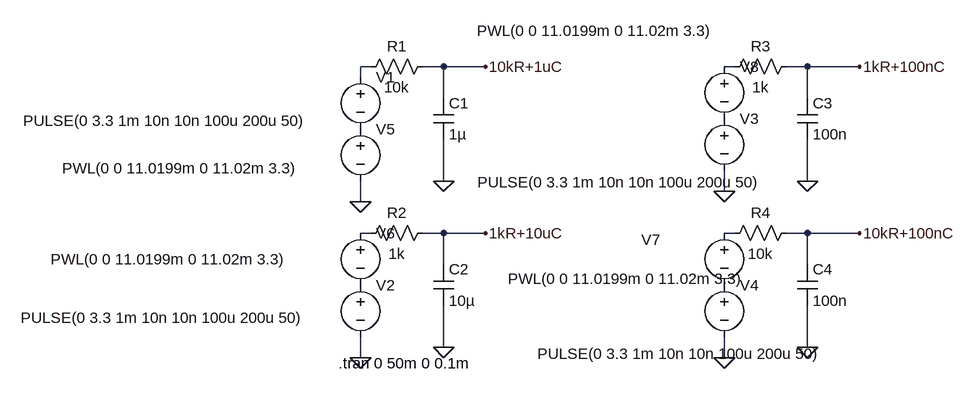
[diagram p0: schematic ButtonDebounce.asc]
ButtonDebounce.asc, the LTspice schematic file:
Version 4
SHEET 1 1108 680
WIRE 16 16 0 16
WIRE 128 16 96 16
WIRE 192 16 128 16
WIRE 576 16 560 16
WIRE 688 16 656 16
WIRE 768 16 688 16
WIRE 0 32 0 16
WIRE 128 64 128 16
WIRE 688 64 688 16
WIRE 128 192 128 128
WIRE 688 192 688 128
WIRE 560 208 560 176
WIRE 0 224 0 192
WIRE 16 272 0 272
WIRE 128 272 96 272
WIRE 192 272 128 272
WIRE 576 272 560 272
WIRE 688 272 656 272
WIRE 768 272 688 272
WIRE 128 320 128 272
WIRE 688 320 688 272
WIRE 128 448 128 384
WIRE 688 448 688 384
WIRE 0 464 0 432
WIRE 560 464 560 432
FLAG 128 192 0
FLAG 0 464 0
FLAG 128 448 0
FLAG 560 208 0
FLAG 688 192 0
FLAG 560 464 0
FLAG 688 448 0
FLAG 0 224 0
FLAG 768 272 10kR+100nC
FLAG 768 16 1kR+100nC
FLAG 192 16 10kR+1uC
FLAG 192 272 1kR+10uC
SYMBOL voltage 0 16 R0
WINDOW 3 -519 83 Left 2
WINDOW 123 0 0 Left 2
WINDOW 39 0 0 Left 2
SYMATTR InstName V1
SYMATTR Value PULSE(0 3.3 1m 10n 10n 100u 200u 50)
SYMBOL cap 112 64 R0
SYMATTR InstName C1
SYMATTR Value 1µ
SYMBOL res 0 32 R270
WINDOW 0 32 56 VTop 2
WINDOW 3 0 56 VBottom 2
SYMATTR InstName R1
SYMATTR Value 10k
SYMBOL voltage 0 336 R0
WINDOW 3 -523 66 Left 2
WINDOW 123 0 0 Left 2
WINDOW 39 0 0 Left 2
SYMATTR InstName V2
SYMATTR Value PULSE(0 3.3 1m 10n 10n 100u 200u 50)
SYMBOL cap 112 320 R0
SYMATTR InstName C2
SYMATTR Value 10µ
SYMBOL res 0 288 R270
WINDOW 0 32 56 VTop 2
WINDOW 3 0 56 VBottom 2
SYMATTR InstName R2
SYMATTR Value 1k
SYMBOL voltage 560 80 R0
WINDOW 3 -380 114 Left 2
WINDOW 123 0 0 Left 2
WINDOW 39 0 0 Left 2
SYMATTR InstName V3
SYMATTR Value PULSE(0 3.3 1m 10n 10n 100u 200u 50)
SYMBOL cap 672 64 R0
SYMATTR InstName C3
SYMATTR Value 100n
SYMBOL res 560 32 R270
WINDOW 0 32 56 VTop 2
WINDOW 3 0 56 VBottom 2
SYMATTR InstName R3
SYMATTR Value 1k
SYMBOL voltage 560 336 R0
WINDOW 3 -288 122 Left 2
WINDOW 123 0 0 Left 2
WINDOW 39 0 0 Left 2
SYMATTR InstName V4
SYMATTR Value PULSE(0 3.3 1m 10n 10n 100u 200u 50)
SYMBOL cap 672 320 R0
SYMATTR InstName C4
SYMATTR Value 100n
SYMBOL res 560 288 R270
WINDOW 0 32 56 VTop 2
WINDOW 3 0 56 VBottom 2
SYMATTR InstName R4
SYMATTR Value 10k
SYMBOL voltage 0 96 R0
WINDOW 3 -459 76 Left 2
WINDOW 123 0 0 Left 2
WINDOW 39 0 0 Left 2
SYMATTR InstName V5
SYMATTR Value PWL(0 0 11.0199m 0 11.02m 3.3)
SYMBOL voltage 0 256 R0
WINDOW 3 -477 56 Left 2
WINDOW 123 0 0 Left 2
WINDOW 39 0 0 Left 2
SYMATTR InstName V6
SYMATTR Value PWL(0 0 11.0199m 0 11.02m 3.3)
SYMBOL voltage 560 256 R0
WINDOW 0 -128 26 Left 2
WINDOW 3 -333 86 Left 2
WINDOW 123 0 0 Left 2
WINDOW 39 0 0 Left 2
SYMATTR InstName V7
SYMATTR Value PWL(0 0 11.0199m 0 11.02m 3.3)
SYMBOL voltage 560 0 R0
WINDOW 3 -381 -39 Left 2
WINDOW 123 0 0 Left 2
WINDOW 39 0 0 Left 2
SYMATTR InstName V8
SYMATTR Value PWL(0 0 11.0199m 0 11.02m 3.3)
TEXT -34 472 Left 2 !.tran 0 50m 0 0.1m

The netlist it stands for:
* ButtonDebounce.asc
V1 N001 P001 PULSE(0 3.3 1m 10n 10n 100u 200u 50)
C1 10kR+1uC 0 1µ
R1 N001 10kR+1uC 10k
V2 P002 0 PULSE(0 3.3 1m 10n 10n 100u 200u 50)
C2 1kR+10uC 0 10µ
R2 N003 1kR+10uC 1k
V3 P003 0 PULSE(0 3.3 1m 10n 10n 100u 200u 50)
C3 1kR+100nC 0 100n
R3 N002 1kR+100nC 1k
V4 P004 0 PULSE(0 3.3 1m 10n 10n 100u 200u 50)
C4 10kR+100nC 0 100n
R4 N004 10kR+100nC 10k
V5 P001 0 PWL(0 0 11.0199m 0 11.02m 3.3)
V6 N003 P002 PWL(0 0 11.0199m 0 11.02m 3.3)
V7 N004 P004 PWL(0 0 11.0199m 0 11.02m 3.3)
V8 N002 P003 PWL(0 0 11.0199m 0 11.02m 3.3)
.tran 0 50m 0 0.1m
.backanno
.end

* Results of the author's LTspice run, read from the files saved beside the schematic
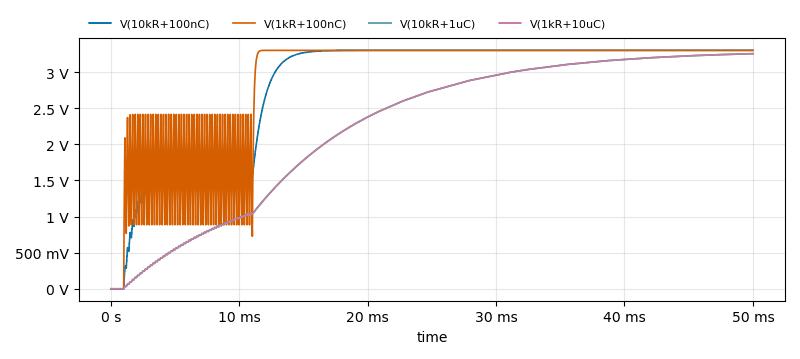
[diagram p1: Transient Analysis of ButtonDebounce.asc, plotted from the saved traces]
* Transient Analysis, 1 run:
*   V(10kR+100nC): min 0 V, max 3.3 V, average 2.837 V, rms 2.959 V, last 3.3 V
*   V(1kR+100nC): min 0 V, max 3.3 V, average 2.896 V, rms 3.008 V, last 3.3 V
*   V(10kR+1uC): min 0 V, max 3.254 V, average 2.251 V, rms 2.482 V, last 3.254 V
*   V(1kR+10uC): min 0 V, max 3.254 V, average 2.251 V, rms 2.482 V, last 3.254 V